# EAGLE schematic commande_neons (EAGLE 9.6.2)
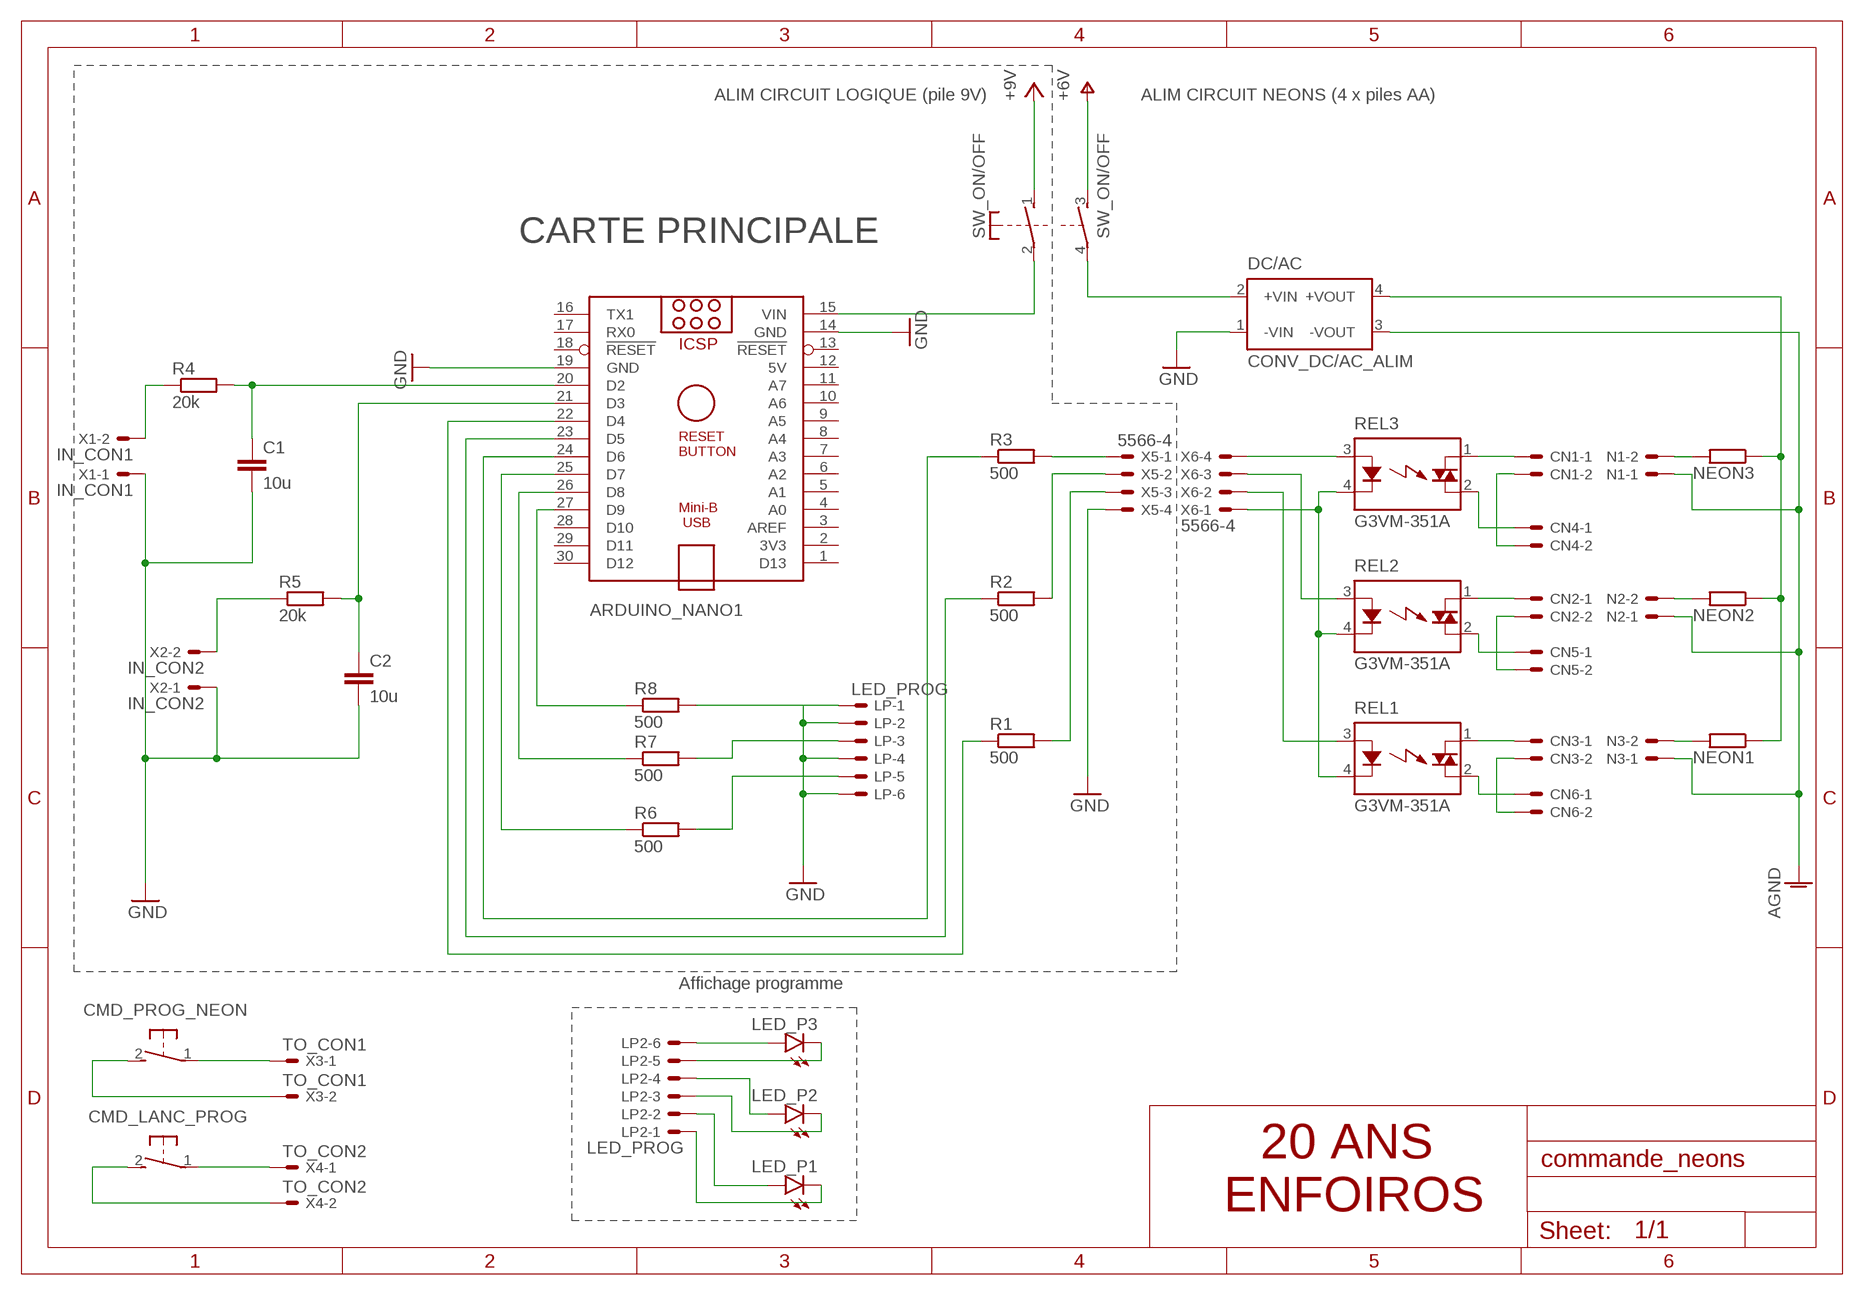
[diagram p0: schematic, sheet 1]

## Parts
ARDUINO_NANO1  ARDUINO_NANO  [ARDUINO_NANO]
C1  10u  C-EU025-024X044  [C025-024X044]
C2  10u  C-EU025-024X044  [C025-024X044]
CMD_LANC_PROG  31-XX  [B3F-31XX]
CMD_PROG_NEON  31-XX  [B3F-31XX]
CN1  22-23-2021  [22-23-2021]
CN2  22-23-2021  [22-23-2021]
CN3  22-23-2021  [22-23-2021]
CN4  22-23-2021  [22-23-2021]
CN5  22-23-2021  [22-23-2021]
CN6  22-23-2021  [22-23-2021]
DC/AC  CONV_DC/AC_ALIM  TME0505S  [TME]
LED_P1  LAP4-BOTTOM  [P47F-BOTTOM]
LED_P2  LAP4-BOTTOM  [P47F-BOTTOM]
LED_P3  LAP4-BOTTOM  [P47F-BOTTOM]
LP  LED_PROG  5566-6  [5566-6]
LP2  LED_PROG  5566-6  [5566-6]
N1  22-23-2021  [22-23-2021]
N2  22-23-2021  [22-23-2021]
N3  22-23-2021  [22-23-2021]
NEON1  R-EU_0411/12  [0411/12]
NEON2  R-EU_0411/12  [0411/12]
NEON3  R-EU_0411/12  [0411/12]
R1  500  R-EU_0204/7  [0204/7]
R2  500  R-EU_0204/7  [0204/7]
R3  500  R-EU_0204/7  [0204/7]
R4  20k  R-EU_0204/5  [0204/5]
R5  20k  R-EU_0204/5  [0204/5]
R6  500  R-EU_0204/7  [0204/7]
R7  500  R-EU_0204/7  [0204/7]
R8  500  R-EU_0204/7  [0204/7]
REL1  G3VM-351A  AQ5A2-ZP3  [AQ1-M]
REL2  G3VM-351A  AQ5A2-ZP3  [AQ1-M]
REL3  G3VM-351A  AQ5A2-ZP3  [AQ1-M]
SW_ON/OFF  PVA1  [PVA1F]
X1  IN_CON1  332-02  [332-02]
X2  IN_CON2  332-02  [332-02]
X3  TO_CON1  332-02  [332-02]
X4  TO_CON2  332-02  [332-02]
X5  5566-4  [5566-4]
X6  5566-4  [5566-4]

## Nets
AGND: DC/AC.3(-VOUT) N1.1 N2.1 N3.1
GND: ARDUINO_NANO1.14(GND) ARDUINO_NANO1.19(GND) C1.2 C2.2 DC/AC.1(-VIN) LP.2 LP.4 LP.6 X1.1 X2.1 X5.4
N$1: ARDUINO_NANO1.22(D4) R1.1
N$2: REL1.3(A) X6.2
N$3: REL1.4(K) REL2.4(K) REL3.4(K) X6.1
N$4: REL3.3(A) X6.4
N$5: ARDUINO_NANO1.23(D5) R2.1
N$6: ARDUINO_NANO1.24(D6) R3.1
N$7: N1.2 NEON3.2
N$8: DC/AC.2(+VIN) SW_ON/OFF.4(2:P)
N$9: REL2.3(A) X6.3
N$10: ARDUINO_NANO1.15(VIN) SW_ON/OFF.2(1:P)
N$11: DC/AC.4(+VOUT) NEON1.1 NEON2.1 NEON3.1
N$12: R4.1 X1.2
N$13: N2.2 NEON2.2
N$14: ARDUINO_NANO1.25(D7) R6.1
N$15: ARDUINO_NANO1.26(D8) R7.1
N$16: ARDUINO_NANO1.27(D9) R8.1
N$17: ARDUINO_NANO1.20(D2) C1.1 R4.2
N$18: R5.1 X2.2
N$19: ARDUINO_NANO1.21(D3) C2.1 R5.2
N$20: N3.2 NEON1.2
N$21: R3.2 X5.1
N$22: R2.2 X5.2
N$23: R1.2 X5.3
N$25: CN1.1 REL3.1(DS1)
N$26: CN1.2 CN4.2
N$27: CN4.1 REL3.2(DS2)
N$28: CN2.1 REL2.1(DS1)
N$29: CN5.1 REL2.2(DS2)
N$30: CN2.2 CN5.2
N$31: CN3.1 REL1.1(DS1)
N$32: CMD_PROG_NEON.1(P) X3.1
N$33: CMD_PROG_NEON.2(S) X3.2
N$34: CMD_LANC_PROG.1(P) X4.1
N$35: CMD_LANC_PROG.2(S) X4.2
N$36: LP.1 R8.2
N$37: LP.3 R7.2
N$38: LP.5 R6.2
N$39: LED_P3.A LP2.6
N$40: LED_P3.C LP2.5
N$41: LED_P2.A LP2.4
N$42: LED_P2.C LP2.3
N$43: LED_P1.A LP2.2
N$44: LED_P1.C LP2.1
N$45: CN6.1 REL1.2(DS2)
N$46: CN3.2 CN6.2
V+: SW_ON/OFF.3(2:S) ; supply symbol labelled +6V
VCC: SW_ON/OFF.1(1:S) ; supply symbol labelled +9V
Unconnected: ARDUINO_NANO1.1(D13) ARDUINO_NANO1.2(3V3) ARDUINO_NANO1.3(AREF) ARDUINO_NANO1.4(A0) ARDUINO_NANO1.5(A1) ARDUINO_NANO1.6(A2) ARDUINO_NANO1.7(A3) ARDUINO_NANO1.8(A4) ARDUINO_NANO1.9(A5) ARDUINO_NANO1.10(A6) ARDUINO_NANO1.11(A7) ARDUINO_NANO1.13(!RESET) ARDUINO_NANO1.16(TX1) ARDUINO_NANO1.17(RX0) ARDUINO_NANO1.18(!RESET) ARDUINO_NANO1.28(D10) ARDUINO_NANO1.29(D11) ARDUINO_NANO1.30(D12)

## Notes on the sheet
- ALIM CIRCUIT LOGIQUE (pile 9V) | ALIM CIRCUIT NEONS (4 x piles AA)
- CARTE PRINCIPALE
- Affichage programme
- 20 ANS 
  ENFOIROS

## Power pins joined to a net without a drawn wire
5V: ARDUINO_NANO1.12(5V)

## Library data of the parts
ARDUINO_NANO1 = ArduinoNanoV30:ARDUINO_NANO: Arduino Nano V3.0 Overview: The Arduino Nano is a small, complete, and breadboard-friendly board based on the ATmega328 (Arduino Nano 3.x) or ATmega168 (Arduino Nano 2.x). It has more or less the same functionality of the Arduino Duemilanove, but in a different package. It lacks only a DC power jack, and works with a Mini-B USB cable instead of a standard one. The Nano was designed and is being produced by Gravitech. Specifications: Microcontroller Atmel ATmega168 or ATmega328 Operating Voltage (logic level) 5 V Input Voltage (recommended) 7-12 V Input Voltage (limits) 6-20 V Digital I/O Pins 14 (of which 6 provide PWM output) Analog Input Pins 8 DC Current per I/O Pin 40 mA Flash Memory 16 KB (ATmega168) or 32 KB (ATmega328) of which 2 KB used by bootloader SRAM 1 KB (ATmega168) or 2 KB (ATmega328) EEPROM 512 bytes (ATmega168) or 1 KB (ATmega328) Clock Speed 16 MHz Dimensions 0.73" x 1.70" Length 45 mm Width 18 mm Weigth 5 g Power: The Arduino Nano can be powered via the Mini-B USB connection, 6-20V unregulated external power supply (pin 30), or 5V regulated external power supply (pin 27). The power source is automatically selected to the highest voltage source. Memory: The ATmega168 has 16 KB of flash memory for storing code (of which 2 KB is used for the bootloader); the ATmega328 has 32 KB, (also with 2 KB used for the bootloader). The ATmega168 has 1 KB of SRAM and 512 bytes of EEPROM (which can be read and written with the EEPROM library); the ATmega328 has 2 KB of SRAM and 1 KB of EEPROM. Input and Output: Each of the 14 digital pins on the Nano can be used as an input or output, using pinMode(), digitalWrite(), and digitalRead() functions. They operate at 5 volts. Each pin can provide or receive a maximum of 40 mA and has an internal pull-up resistor (disconnected by default) of 20-50 kOhms. In addition, some pins have specialized functions. Visit Arduino - ArduinoBoardNano <https://www.arduino.cc/en/Main/ArduinoBoardNano>
C1 C2 = resistor:C-EU: CAPACITOR, European symbol
CMD_LANC_PROG CMD_PROG_NEON = switch-omron:31-XX: OMRON SWITCH; MPN: B3F-3100; OC_FARNELL: 959704; OC_NEWARK: 36M3582
CN1-CN6 N1-N3 = con-molex:22-23-2021: .100" (2.54mm) Center Header - 2 Pin; MF: MOLEX; MPN: 22-23-2021; OC_FARNELL: 1462926; OC_NEWARK: 25C3832
DC/AC = traco-electronic:TME?*: DC/DC Converter TME Series 1 Watt Source: www.tracopower.com .. tme.pdf; MPN: TME 0505S; OC_FARNELL: 1007538; OC_NEWARK: 51R5321
LED_P1-LED_P3 = led:*P4: PointLED® Enhanced Thinfilm LED TOP & BOTTOM mount LS P47F, LR P47F, LA P47F, LY P47F, LT P4SG, LB P4SG, LW P4SG Source: http://catalog.osram-os.com .. LA_LR_LS_LY_P47F_Pb_free.pdf
LP LP2 = con-molex:5566-6: Mini FIT connector 6 pol Source: http://www.molex.com; MF: MOLEX; MPN: 95566-61002; OC_FARNELL: unknown; OC_NEWARK: 22K8620
NEON1-NEON3 R1-R8 = resistor:R-EU_: RESISTOR, European symbol
REL1-REL3 = relay:AQ?: SOLID STATE RELAY NAiS Source: http://www.mew-europe.com/.. en_ds_61601_0000.pdf; MPN: AQ5A2-ZP3/28VDC; OC_FARNELL: unknown; OC_NEWARK: 13P1233
SW_ON/OFF = switch-misc:PVA1: ITT SWITCH
X1-X4 = con-garry:332-02: 2 Pin - 2mm Dual Row Source: www.mpe-connector.de / garry_shortform_2012.pdf
X5 X6 = con-molex:5566-4: Mini FIT connector 4 pol Source: http://www.molex.com; MF: MOLEX; OC_FARNELL: unknown; OC_NEWARK: unknown